# Altium schematic sheet ADC.SchDoc: 24-bit Analog to Digital converter
size A4; Date: 30.05.2015; Author: Grzegorz Gajoch; DocumentNumber: 7; SheetNumber: 7; SheetTotal: 9; Model: EM1; PageSetup: Record=PageOptions|CenterHorizontal=True|CenterVertical=True|PrintScale=0.52|XCorrection=1.00|YCorrection=1.00|PrintKind=1|BorderSize=5000000|LeftOffset=0|BottomOffset=0|Orientation=2|PaperLength=4200|PaperWidth=2970|Scale=100|PaperSource=7|PrintQuality=600|MediaType=1|DitherType=10|PaperKind=A3|PrintScaleMode=1
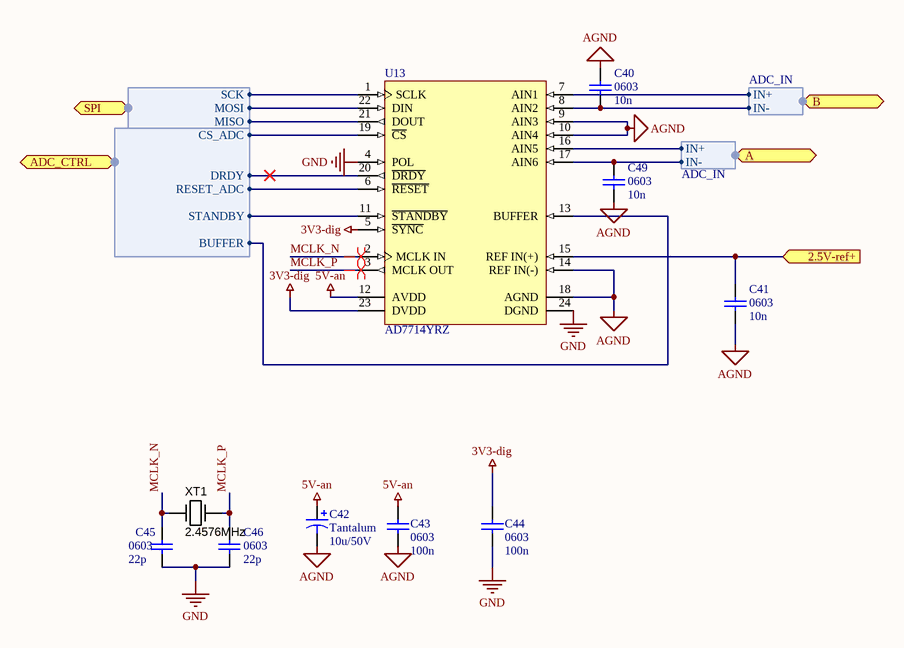
[diagram p0: ADC.SchDoc]

## Parts
C40  0603  value 10n  [SMD_Capacitor_0603]
C41  0603  value 10n  [SMD_Capacitor_0603]
C42  Tantalum  value 10u/50V  [Tantalum_cap_D]
C43  0603  value 100n  [SMD_Capacitor_0603]
C44  0603  value 100n  [SMD_Capacitor_0603]
C45  0603  value 22p  [SMD_Capacitor_0603]
C46  0603  value 22p  [SMD_Capacitor_0603]
C49  0603  value 10n  [SMD_Capacitor_0603]
U13  AD7714YRZ  [RW-24_M]
XT1  2.4576MHz  [HC49U]

## Ports
2.5V-ref+ (in), A (harness ADC_IN), ADC_CTRL (harness ADC_CTRL), B (harness ADC_IN), SPI (harness SPI)

## Harnesses
ADC_CTRL: CS_ADC, DRDY, RESET_ADC, STANDBY, BUFFER
SPI: SCK, MOSI, MISO
ADC_IN: IN+, IN-

## Nets
3V3-dig: C44.2 U13.5(~{SYNC}) U13.23(DVDD)
5V-an: C42.1 C43.2 U13.12(AVDD)
AGND: C40.2 C41.1 C42.2 C43.1 C49.1 U13.9(AIN3) U13.10(AIN4) U13.14(REF_IN(-)) U13.18(AGND)
GND: C44.1 C45.1 C46.1 U13.4(POL) U13.24(DGND)
2.5V-ref+: C41.2 U13.15(REF_IN(+)) ; port 2.5V-ref+
MCLK_N: C45.2 U13.2(MCLK_IN) XT1.1(IN)
MCLK_P: C46.2 U13.3(MCLK_OUT) XT1.2(OUT)
NetC40_1: C40.1 U13.8(AIN2) ; port B.IN-
NetC49_2: C49.2 U13.17(AIN6) ; port A.IN-
NetU13_1: U13.1(SCLK) ; port SPI.SCK
NetU13_6: U13.6(~{RESET}) ; port ADC_CTRL.RESET_ADC
NetU13_7: U13.7(AIN1) ; port B.IN+
NetU13_11: U13.11(~{STANDBY}) ; port ADC_CTRL.STANDBY
NetU13_13: U13.13(BUFFER) ; port ADC_CTRL.BUFFER
NetU13_16: U13.16(AIN5) ; port A.IN+
NetU13_19: U13.19(~{CS}) ; port ADC_CTRL.CS_ADC
NetU13_20: U13.20(~{DRDY}) ; port ADC_CTRL.DRDY
NetU13_21: U13.21(DOUT) ; port SPI.MISO
NetU13_22: U13.22(DIN) ; port SPI.MOSI

## Layout directives
differential pair: MCLK_N, MCLK_P

## Notes on the sheet
- Title:
- Sheet:
- of
- Author:
- Model:
- Document Number:
- Checked by:
- Iss-Rev:
- Approved by:
- Date:
- File name:

## Library data of the parts
C40 C41 C43-C46 C49 = Cap1: Capacitor; Published: 8-Jun-2000; LatestRevisionDate: 17-Jul-2002; LatestRevisionNote: Re-released for DXP Platform.; PackageReference: RAD-0.3; Publisher: Altium Limited; PackageDescription: Radial Cap, Thru-Hole; 2 Leads; 0.3 in Pin Spacing
C42 = Cap Pol1: Polarized Capacitor (Radial); Published: 8-Jun-2000; LatestRevisionDate: 17-Jul-2002; LatestRevisionNote: Re-released for DXP Platform.; PackageReference: RB7.6-15; Publisher: Altium Limited; PackageDescription: Polarized Capacitor (Radial); 2 Leads
U13 = AD7714YRZ: 5 Channel 24-Bit Signal Conditioning Analog-to-Digital Converter with Serial, SPI Interface, 500 uA, CMOS, 3 V / 5 V, 1KSPS, -40 to +105 degC, RW-24, Pb-Free, Tube; Generic Part Number: AD7714; Manufacturer: Analog Devices; Resolution (Bits): 24; Channels: 5; Throughput Rate (SPS): 1K; Interface: Ser, SPI; DatasheetVersion: Rev.C; PackageVersion: 060706-A; PackageReference: RW-24; PackageDescription: 24-Lead Standard Small Outline Package [SOIC_W]; Supplier 1: Digi-Key; Supplier Part Number 1: AD7714YRZ-ND; Supplier 2: Farnell; Supplier Part Number 2: 1438858; Supplier 3: Newark; Supplier Part Number 3: 15P0854; Supplier 4: Newark; Supplier Part Number 4: 59K5335; Supplier 5: Mouser; Supplier Part Number 5: 584-AD7714YRZ; RoHS: Y; Packing: Tube; Mounting Technology: Surface Mount; Code_JEDEC: MS-013-AD; PartNumber: AD7714YRZ; ComponentLink1Description: Manufacturer URL; ComponentLink1URL: http://www.analog.com/en/index.html; ComponentLink2Description: Datasheet; ComponentLink2URL: http://www.analog.com/static/imported-files/data_sheets/AD7714.pdf; ComponentLink3Description: Package Specification; ComponentLink3URL: http://www.analog.com/static/imported-files/packages/33665150946139RW_24.pdf; ComponentLink4Description: Product URL; ComponentLink4URL: http://www.analog.com/en/analog-to-digital-converters/ad-converters/ad7714/products/product.html
XT1 = Crystal: AKER  C-2.4576-18-3050-X; Manufacturer 1: Citizen Finetech Miyota; Manufacturer Part Number 1: CMR309T-6.000MABJ-UT; Ratings: 6.00 MHz; Frequency: 6MHz; Frequency Stability: ±50ppm; Frequency Tolerance: ±30ppm; Load Capacitance: 18pF; Operating Mode: Fundamental; SCDType: spec; Package / Case: Cylindrical Can, Radial; Type: MHz Crystal; Operating Temperature: -10°C ~ 60°C; Mounting Type: Surface Mount; Size / Dimension: 0.118" Dia x 0.346" L (3.00mm x 8.80mm); Height: 0.122" (3.10mm); Supplier 1: Digi-Key; Supplier Part Number 1: 300-8348-1-ND; Tolerance: ±50ppm; ComponentLink1URL: http://media.digikey.com/pdf/Data%20Sheets/Citizen%20PDFs/CMR310T%20CMR309T.pdf; ComponentLink1Description: http://media.digikey.com/pdf/Data%20Sheets/Citizen%20PDFs/CMR310T%20CMR309T.pdf; Value: 2.4576MHz